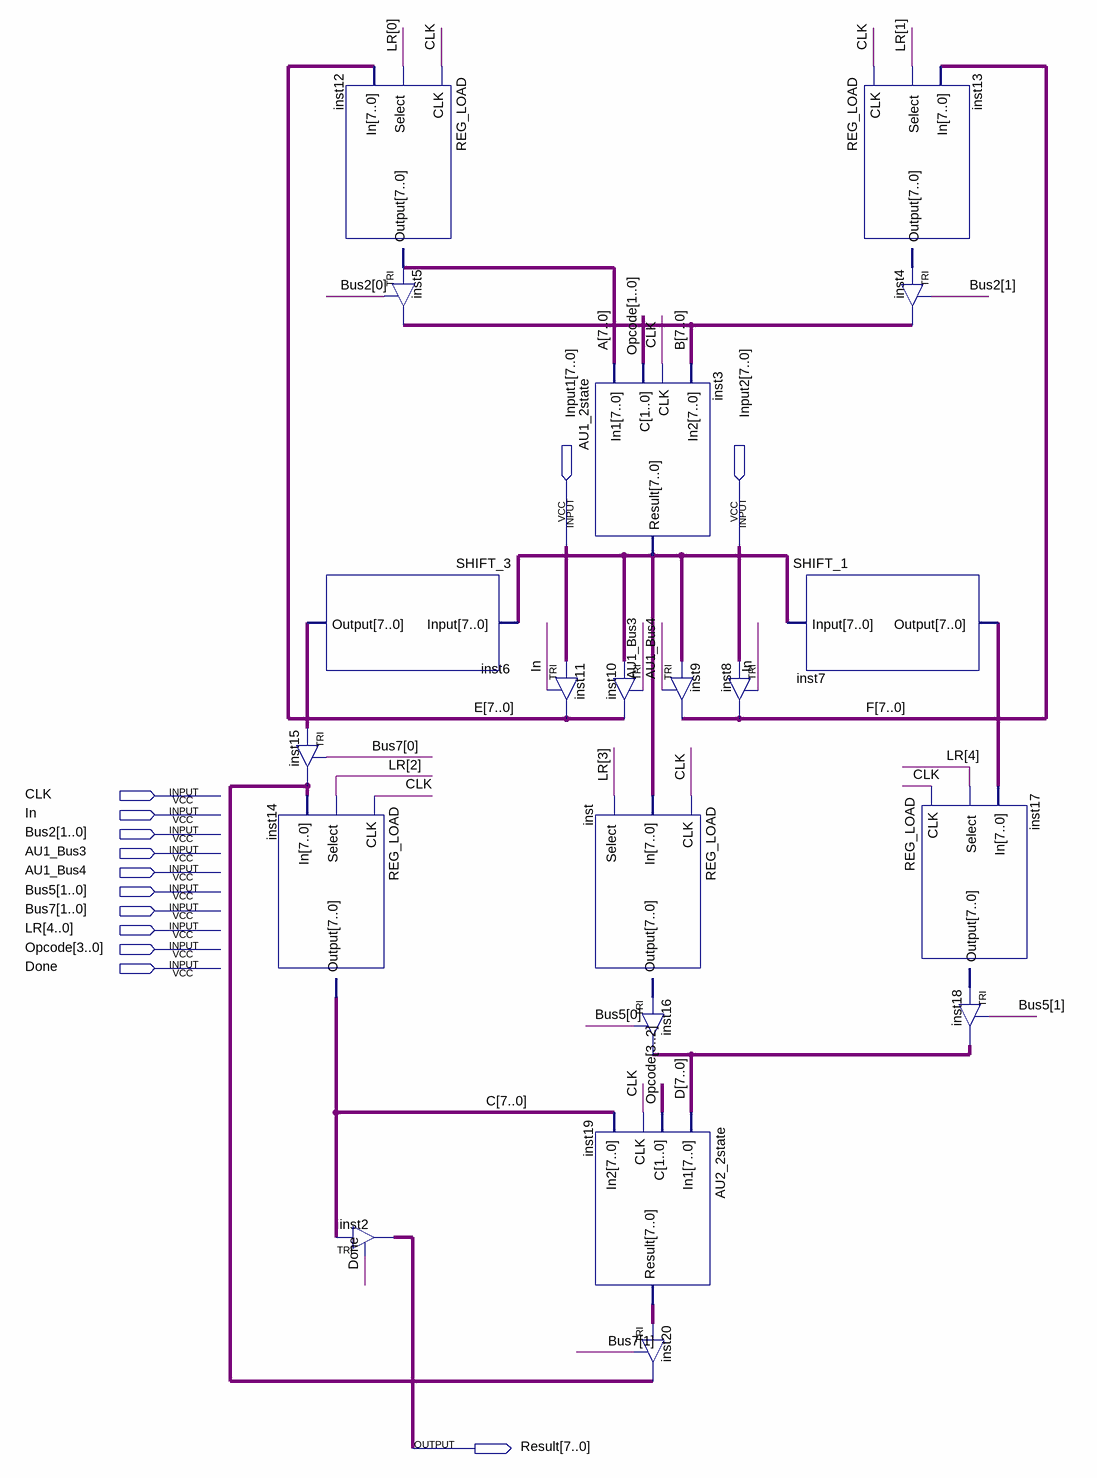
[diagram p0: schematic sheet]
// Quartus schematic Datapath_ver7.bdf as structural Verilog: 20 symbols, 13 pins
module Datapath_ver7 (
  input  [7:0] Input1,
  input  [7:0] Input2,
  input  CLK,
  input  In,
  input  [1:0] Bus2,
  input  AU1_Bus3,
  input  AU1_Bus4,
  input  [1:0] Bus5,
  input  [1:0] Bus7,
  input  [4:0] LR,
  input  [3:0] Opcode,
  input  Done,
  output [7:0] Result
);

  wire [7:0] A, B, C, D, E, F, inst3_result, inst6_output, inst7_output, inst13_output, inst15_out,
       inst17_output, inst19_result, inst_output;

  SHIFT_3 inst6 (.Input(inst3_result), .Output(inst6_output));
  TRI inst15[7:0] (.IN(inst6_output), .OE(Bus7[0]), .OUT(inst15_out));
  REG_LOAD inst14 (.CLK(CLK), .In(inst15_out), .Select(LR[2]), .Output(C));
  REG_LOAD inst12 (.CLK(CLK), .In(E), .Select(LR[0]), .Output(A));
  TRI inst5[7:0] (.IN(A), .OE(Bus2[0]), .OUT(B));
  TRI inst2[7:0] (.IN(C), .OE(Done), .OUT(Result));
  AU1_2state inst3 (.In1(A), .In2(B), .C(Opcode[1:0]), .CLK(CLK), .Result(inst3_result));
  TRI inst10[7:0] (.IN(inst3_result), .OE(AU1_Bus3), .OUT(E));
  TRI inst11[7:0] (.IN(Input1), .OE(In), .OUT(E));
  REG_LOAD inst (.CLK(CLK), .In(inst3_result), .Select(LR[3]), .Output(inst_output));
  AU2_2state inst19 (.In1(D), .In2(C), .C(Opcode[3:2]), .CLK(CLK), .Result(inst19_result));
  TRI inst9[7:0] (.IN(inst3_result), .OE(AU1_Bus4), .OUT(F));
  TRI inst16[7:0] (.IN(inst_output), .OE(Bus5[0]), .OUT(D));
  TRI inst20[7:0] (.IN(inst19_result), .OE(Bus7[1]), .OUT(inst15_out));
  TRI inst8[7:0] (.IN(Input2), .OE(In), .OUT(F));
  REG_LOAD inst13 (.CLK(CLK), .In(F), .Select(LR[1]), .Output(inst13_output));
  SHIFT_1 inst7 (.Input(inst3_result), .Output(inst7_output));
  TRI inst4[7:0] (.IN(inst13_output), .OE(Bus2[1]), .OUT(B));
  REG_LOAD inst17 (.CLK(CLK), .In(inst7_output), .Select(LR[4]), .Output(inst17_output));
  TRI inst18[7:0] (.IN(inst17_output), .OE(Bus5[1]), .OUT(D));
endmodule
